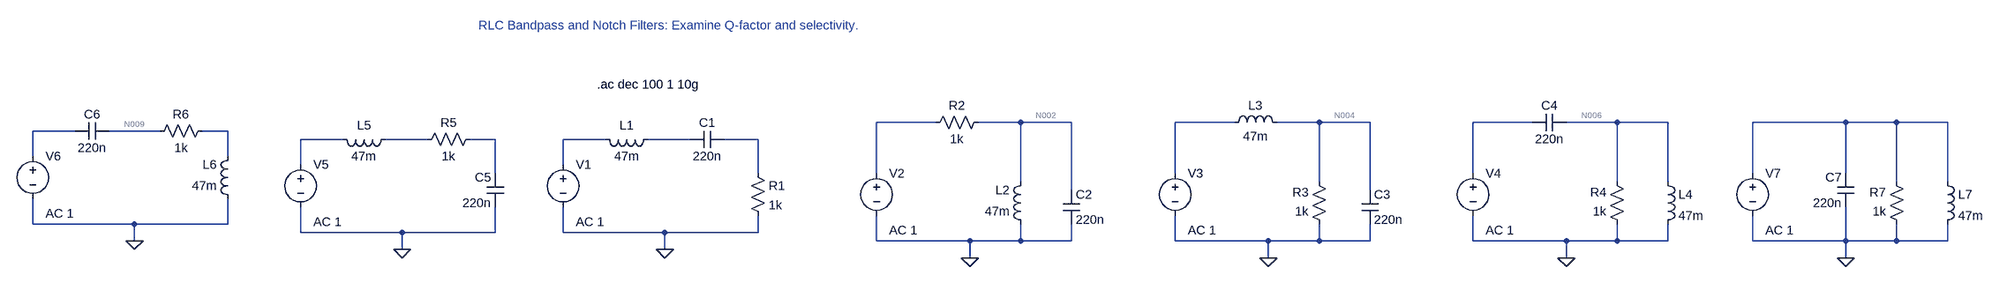
[diagram p0: schematic RLC bandpass and notch.asc]
RLC bandpass and notch.asc, the LTspice schematic file:
Version 4
SHEET 1 2780 680
WIRE 720 48 608 48
WIRE 880 48 800 48
WIRE 976 48 880 48
WIRE 1344 48 1232 48
WIRE 1504 48 1424 48
WIRE 1600 48 1504 48
WIRE 1920 48 1808 48
WIRE 2080 48 1984 48
WIRE 2176 48 2080 48
WIRE 2512 48 2336 48
WIRE 2608 48 2512 48
WIRE 2704 48 2608 48
WIRE -944 64 -1024 64
WIRE -784 64 -880 64
WIRE -656 64 -704 64
WIRE -400 80 -480 80
WIRE -240 80 -320 80
WIRE -112 80 -160 80
WIRE 96 80 16 80
WIRE 256 80 176 80
WIRE 384 80 320 80
WIRE -1024 112 -1024 64
WIRE -656 112 -656 64
WIRE -480 128 -480 80
WIRE 16 128 16 80
WIRE -112 144 -112 80
WIRE 384 144 384 80
WIRE 608 144 608 48
WIRE 1232 144 1232 48
WIRE 1808 144 1808 48
WIRE 2336 144 2336 48
WIRE 2512 144 2512 48
WIRE 880 160 880 48
WIRE 1504 160 1504 48
WIRE 2080 160 2080 48
WIRE 2176 160 2176 48
WIRE 2608 160 2608 48
WIRE 2704 160 2704 48
WIRE 976 176 976 48
WIRE 1600 176 1600 48
WIRE -1024 240 -1024 192
WIRE -832 240 -1024 240
WIRE -656 240 -656 192
WIRE -656 240 -832 240
WIRE -480 256 -480 208
WIRE -288 256 -480 256
WIRE -112 256 -112 208
WIRE -112 256 -288 256
WIRE 16 256 16 208
WIRE 208 256 16 256
WIRE 384 256 384 224
WIRE 384 256 208 256
WIRE -832 272 -832 240
WIRE 608 272 608 224
WIRE 784 272 608 272
WIRE 880 272 880 240
WIRE 880 272 784 272
WIRE 976 272 976 240
WIRE 976 272 880 272
WIRE 1232 272 1232 224
WIRE 1408 272 1232 272
WIRE 1504 272 1504 240
WIRE 1504 272 1408 272
WIRE 1600 272 1600 240
WIRE 1600 272 1504 272
WIRE 1808 272 1808 224
WIRE 1984 272 1808 272
WIRE 2080 272 2080 240
WIRE 2080 272 1984 272
WIRE 2176 272 2176 240
WIRE 2176 272 2080 272
WIRE 2336 272 2336 224
WIRE 2512 272 2512 208
WIRE 2512 272 2336 272
WIRE 2608 272 2608 240
WIRE 2608 272 2512 272
WIRE 2704 272 2704 240
WIRE 2704 272 2608 272
WIRE -288 288 -288 256
WIRE 208 288 208 256
WIRE 784 304 784 272
WIRE 1408 304 1408 272
WIRE 1984 304 1984 272
WIRE 2512 304 2512 272
FLAG 208 288 0
FLAG 784 304 0
FLAG 1408 304 0
FLAG 1984 304 0
FLAG -288 288 0
FLAG -832 272 0
FLAG 2512 304 0
SYMBOL voltage 16 112 R0
WINDOW 123 24 124 Left 2
WINDOW 39 0 0 Left 0
SYMATTR InstName V1
SYMATTR Value ""
SYMATTR Value2 AC 1
SYMBOL res 368 128 R0
SYMATTR InstName R1
SYMATTR Value 1k
SYMBOL ind 192 64 R90
WINDOW 0 5 56 VBottom 2
WINDOW 3 32 56 VTop 2
SYMATTR InstName L1
SYMATTR Value 47m
SYMBOL cap 320 64 R90
WINDOW 0 0 32 VBottom 2
WINDOW 3 32 32 VTop 2
SYMATTR InstName C1
SYMATTR Value 220n
SYMBOL voltage 608 128 R0
WINDOW 123 24 124 Left 2
WINDOW 39 0 0 Left 0
SYMATTR InstName V2
SYMATTR Value ""
SYMATTR Value2 AC 1
SYMBOL ind 896 256 R180
WINDOW 0 36 80 Left 2
WINDOW 3 36 40 Left 2
SYMATTR InstName L2
SYMATTR Value 47m
SYMBOL cap 960 176 R0
SYMATTR InstName C2
SYMATTR Value 220n
SYMBOL res 816 32 R90
WINDOW 0 0 56 VBottom 2
WINDOW 3 32 56 VTop 2
SYMATTR InstName R2
SYMATTR Value 1k
SYMBOL voltage 1232 128 R0
WINDOW 123 24 124 Left 2
WINDOW 39 0 0 Left 0
SYMATTR InstName V3
SYMATTR Value ""
SYMATTR Value2 AC 1
SYMBOL ind 1328 64 R270
WINDOW 0 32 56 VTop 2
WINDOW 3 5 56 VBottom 2
SYMATTR InstName L3
SYMATTR Value 47m
SYMBOL cap 1584 176 R0
SYMATTR InstName C3
SYMATTR Value 220n
SYMBOL res 1520 256 R180
WINDOW 0 36 76 Left 2
WINDOW 3 36 40 Left 2
SYMATTR InstName R3
SYMATTR Value 1k
SYMBOL voltage 1808 128 R0
WINDOW 123 24 124 Left 2
WINDOW 39 0 0 Left 0
SYMATTR InstName V4
SYMATTR Value ""
SYMATTR Value2 AC 1
SYMBOL ind 2160 144 R0
SYMATTR InstName L4
SYMATTR Value 47m
SYMBOL cap 1984 32 R90
WINDOW 0 0 32 VBottom 2
WINDOW 3 32 32 VTop 2
SYMATTR InstName C4
SYMATTR Value 220n
SYMBOL res 2096 256 R180
WINDOW 0 36 76 Left 2
WINDOW 3 36 40 Left 2
SYMATTR InstName R4
SYMATTR Value 1k
SYMBOL voltage -480 112 R0
WINDOW 123 24 124 Left 2
WINDOW 39 0 0 Left 0
SYMATTR InstName V5
SYMATTR Value ""
SYMATTR Value2 AC 1
SYMBOL res -144 64 R90
WINDOW 0 0 56 VBottom 2
WINDOW 3 32 56 VTop 2
SYMATTR InstName R5
SYMATTR Value 1k
SYMBOL ind -304 64 R90
WINDOW 0 5 56 VBottom 2
WINDOW 3 32 56 VTop 2
SYMATTR InstName L5
SYMATTR Value 47m
SYMBOL cap -96 208 R180
WINDOW 0 24 56 Left 2
WINDOW 3 24 8 Left 2
SYMATTR InstName C5
SYMATTR Value 220n
SYMBOL voltage -1024 96 R0
WINDOW 123 24 124 Left 2
WINDOW 39 0 0 Left 0
SYMATTR InstName V6
SYMATTR Value ""
SYMATTR Value2 AC 1
SYMBOL res -688 48 R90
WINDOW 0 0 56 VBottom 2
WINDOW 3 32 56 VTop 2
SYMATTR InstName R6
SYMATTR Value 1k
SYMBOL ind -640 208 R180
WINDOW 0 36 80 Left 2
WINDOW 3 36 40 Left 2
SYMATTR InstName L6
SYMATTR Value 47m
SYMBOL cap -944 80 R270
WINDOW 0 32 32 VTop 2
WINDOW 3 0 32 VBottom 2
SYMATTR InstName C6
SYMATTR Value 220n
SYMBOL voltage 2336 128 R0
WINDOW 123 24 124 Left 2
WINDOW 39 0 0 Left 0
SYMATTR InstName V7
SYMATTR Value ""
SYMATTR Value2 AC 1
SYMBOL ind 2688 144 R0
SYMATTR InstName L7
SYMATTR Value 47m
SYMBOL cap 2528 208 R180
WINDOW 0 24 56 Left 2
WINDOW 3 24 8 Left 2
SYMATTR InstName C7
SYMATTR Value 220n
SYMBOL res 2624 256 R180
WINDOW 0 36 76 Left 2
WINDOW 3 36 40 Left 2
SYMATTR InstName R7
SYMATTR Value 1k
TEXT -144 -136 Left 2 ;RLC Bandpass and Notch Filters: Examine Q-factor and selectivity.
TEXT 80 -24 Left 2 !.ac dec 100 1 10g

The netlist it stands for:
* RLC bandpass and notch.asc
V1 N014 0 AC 1
R1 N016 0 1k
L1 N015 N014 47m
C1 N016 N015 220n
V2 N001 0 AC 1
L2 0 N002 47m
C2 N002 0 220n
R2 N002 N001 1k
V3 N003 0 AC 1
L3 N003 N004 47m
C3 N004 0 220n
R3 0 N004 1k
V4 N005 0 AC 1
L4 N006 0 47m
C4 N006 N005 220n
R4 0 N006 1k
V5 N011 0 AC 1
R5 N013 N012 1k
L5 N012 N011 47m
C5 0 N013 220n
V6 N008 0 AC 1
R6 N010 N009 1k
L6 0 N010 47m
C6 N008 N009 220n
V7 N007 0 AC 1
L7 N007 0 47m
C7 0 N007 220n
R7 0 N007 1k
* RLC Bandpass and Notch Filters: Examine Q-factor and selectivity.
.ac dec 100 1 10g
.backanno
.end

* Results of the author's LTspice run, read from the files saved beside the schematic
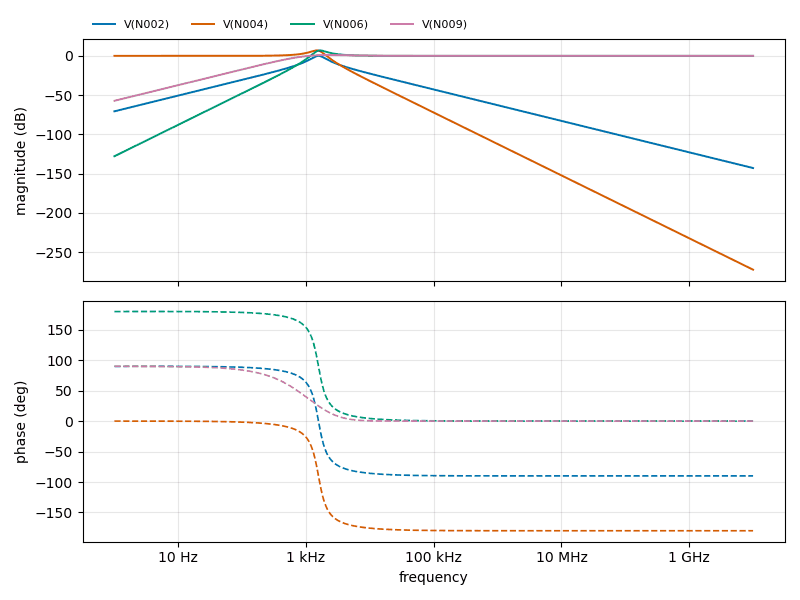
[diagram p1: AC Analysis of RLC bandpass and notch.asc, plotted from the saved traces]
* AC Analysis, 1 run:
*   V(N002): -70.59 dB at 1 Hz, -142.81 dB at 10 GHz, peak -0.01 dB at 1.549 kHz, 3 dB below the peak at 1.244 kHz and 1.969 kHz
*   V(N004): -0.00 dB at 1 Hz, -272.22 dB at 10 GHz, peak 6.94 dB at 1.479 kHz, 3 dB below the peak at 1.042 kHz and 1.814 kHz
*   V(N006): -127.78 dB at 1 Hz, 0.00 dB at 10 GHz, peak 6.94 dB at 1.66 kHz, 3 dB below the peak at 1.351 kHz and 2.35 kHz
*   V(N009): -57.19 dB at 1 Hz, 0.00 dB at 10 GHz, peak 1.11 dB at 2.291 kHz, 3 dB below the peak at 722.4 Hz